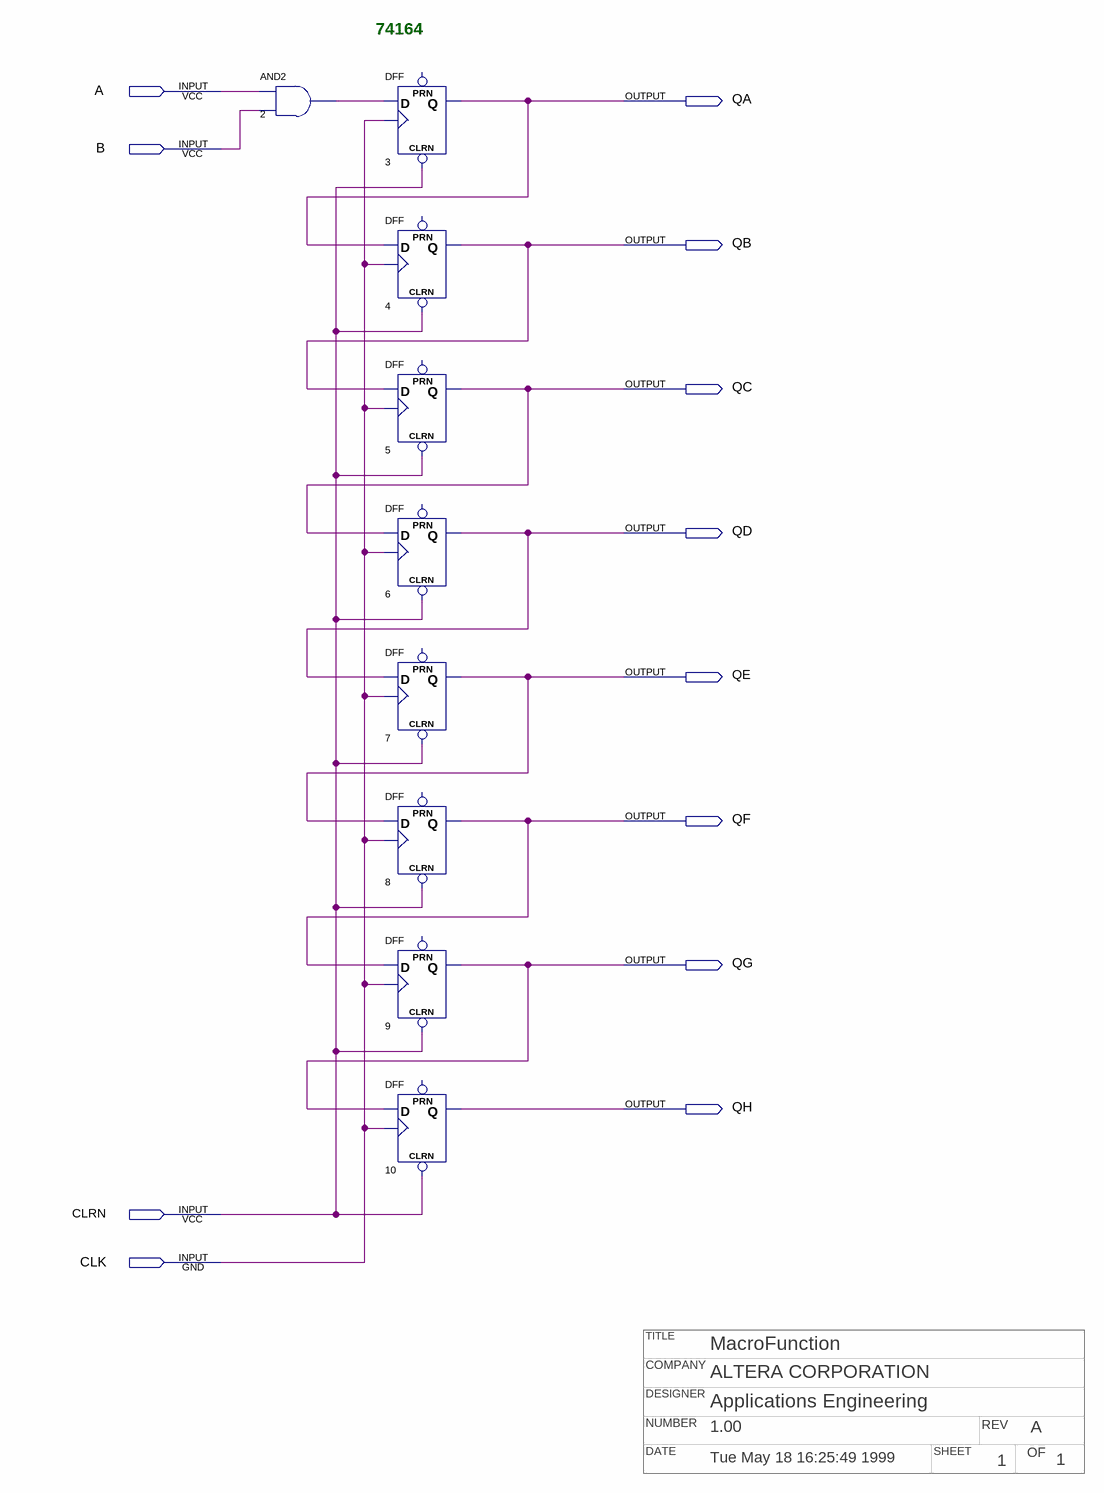
[diagram p0: schematic sheet]
// Quartus schematic 74164.bdf as structural Verilog: 9 symbols, 12 pins
// Title block: TITLE: MacroFunction; COMPANY: ALTERA CORPORATION; DESIGNER: Applications Engineering; NUMBER: 1.00; REV: A; DATE: Tue May 18 16:25:49 1999; SHEET: 1; OF: 1
module \74164  (
  input  A,
  input  B,
  input  CLRN,
  input  CLK,
  output QA,
  output QB,
  output QC,
  output QD,
  output QE,
  output QF,
  output QG,
  output QH
);

  wire n2_out;

  and u_2 (n2_out, A, B);
  DFF u_3 (.CLRN(CLRN), .CLK(CLK), .D(n2_out), .Q(QA));  // open: PRN
  DFF u_4 (.CLRN(CLRN), .CLK(CLK), .D(QA), .Q(QB));  // open: PRN
  DFF u_5 (.CLRN(CLRN), .CLK(CLK), .D(QB), .Q(QC));  // open: PRN
  DFF u_6 (.CLRN(CLRN), .CLK(CLK), .D(QC), .Q(QD));  // open: PRN
  DFF u_7 (.CLRN(CLRN), .CLK(CLK), .D(QD), .Q(QE));  // open: PRN
  DFF u_8 (.CLRN(CLRN), .CLK(CLK), .D(QE), .Q(QF));  // open: PRN
  DFF u_9 (.CLRN(CLRN), .CLK(CLK), .D(QF), .Q(QG));  // open: PRN
  DFF u_10 (.CLRN(CLRN), .CLK(CLK), .D(QG), .Q(QH));  // open: PRN

  // Notes on the sheet:
  //   74164
endmodule
